# Altium project PCB_Project2.PrjPCB
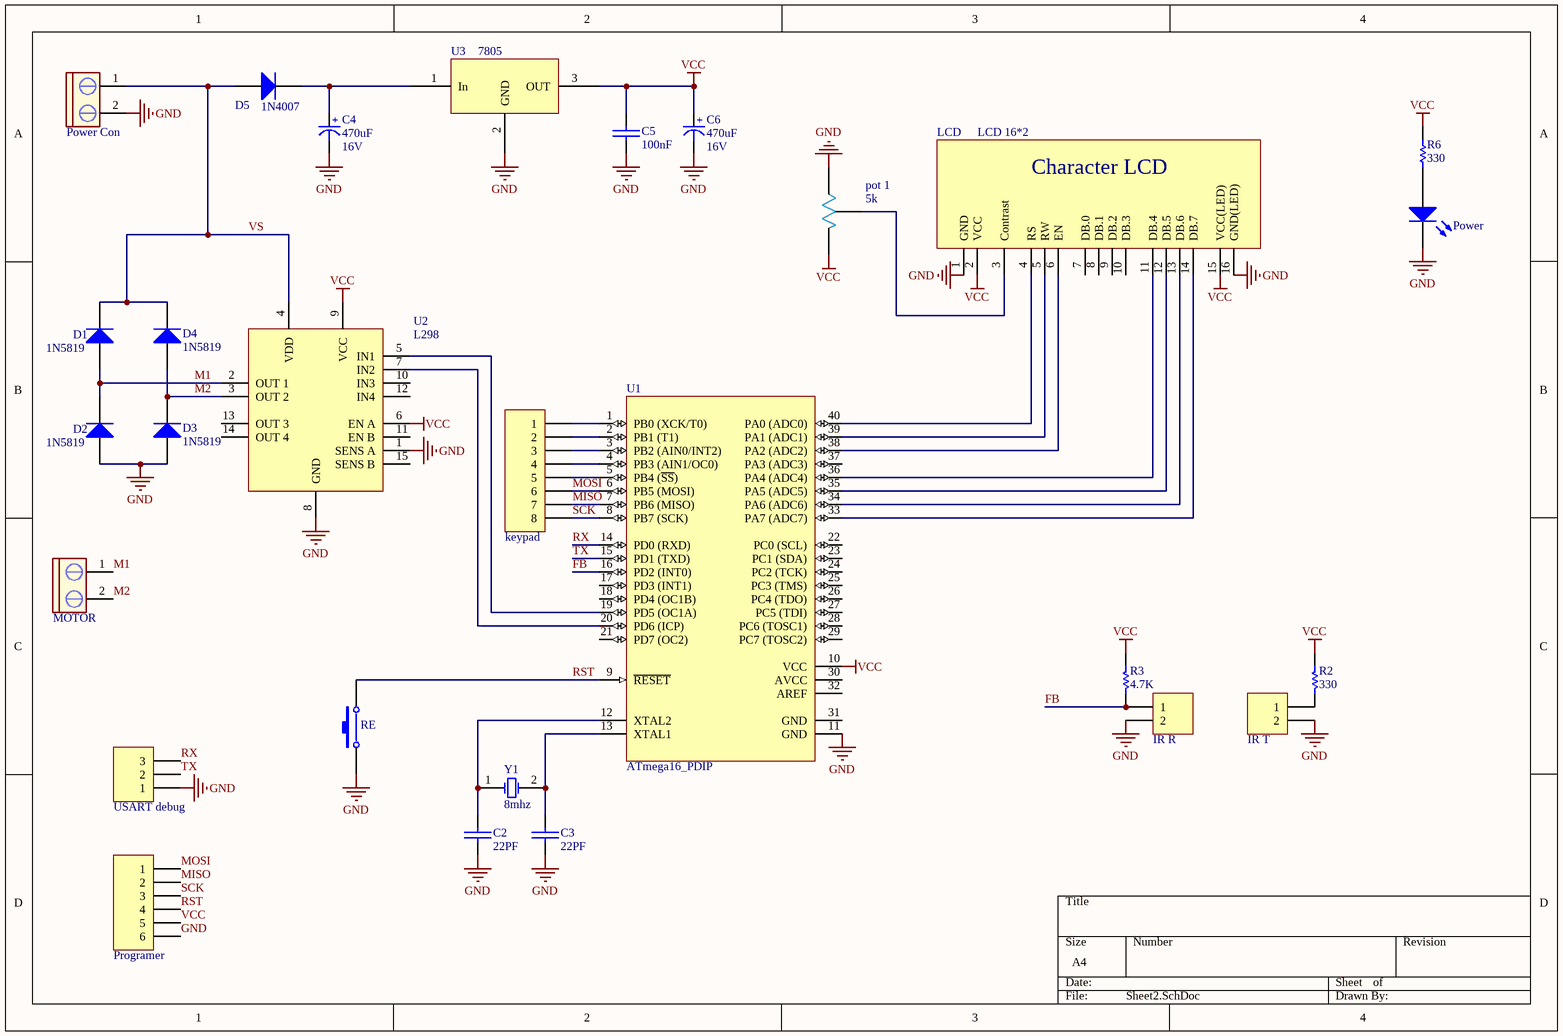
[diagram p0: Sheet2.SchDoc]
1 sheet, 28 parts. Net scope: global (net labels, ports and power ports of the same name join across sheets).
Board file: PCB2.PcbDoc

## Sheet Sheet2.SchDoc
size A4

### Parts
C2  22PF  [Cap - 100nF]
C3  22PF  [Cap - 100nF]
C4  Voltage: 16V  [cap 04]  (hidden comment: 470uF)
C5  100nF  [Cap - 100nF]
C6  Voltage: 16V  [cap 03]  (hidden comment: 470uF)
D1  1N5819  [DO-35]
D2  1N5819  [DO-35]
D3  1N5819  [DO-35]
D4  1N5819  [DO-35]
D5  1N4007  [Diode-1]
IR_R  Pin Header  [SIP2]  (value not drawn)
IR_T  Pin Header  [SIP2]  (value not drawn)
keypad  Pin Header  [SIP8]  (value not drawn)
LCD  LCD 16*2  [LCD2-16]
MOTOR  CON2 pin blue  [My_CN2]  (value not drawn)
pot_1  5k  [POT_1]
Power  LED 5mm  [LED-1]  (value not drawn)
Power_Con  CON2 pin blue  [My_CN2]  (value not drawn)
Programer  Pin Header  [SIP6]  (value not drawn)
R2  330  [AXIAL-0.3]
R3  4.7K  [AXIAL-0.3]
R6  330  [AXIAL-0.3]
RE  PB-2pin  [PB-2pin]  (value not drawn)
U1  ATmega16_PDIP  [DIP40]
U2  L298  [L298]
U3  7805  [TO-220]
USART_debug  Pin Header  [SIP3]  (value not drawn)
Y1  8mhz  [XTAL]

### Nets
GND: C2.2(-) C3.2(-) C4.2(-) C5.2(-) C6.2(-) D2.1(A) D3.1(A) IR_R.2 IR_T.2 LCD.1(GND) LCD.16(GND(LED)) pot_1.1 Power.2(K) Power_Con.2 Programer.6 RE.2 U1.11(GND) U2.1(SENS_A) U2.8(GND) U3.2(GND) USART_debug.1
VCC: C5.1(+) C6.1(+) LCD.2(VCC) LCD.15(VCC(LED)) pot_1.3 Programer.5 R2.1 R3.1 R6.1 U1.10(VCC) U2.6(EN_A) U2.9(VCC) U3.3(OUT)
FB: IR_R.1 R3.2 U1.16(PD2_(INT0))
M1: D1.1(A) D2.2(K) MOTOR.1 U2.2(OUT_1)
M2: D3.2(K) D4.1(A) MOTOR.2 U2.3(OUT_2)
MISO: keypad.7 Programer.2 U1.7(PB6_(MISO))
MOSI: keypad.6 Programer.1 U1.6(PB5_(MOSI))
RST: Programer.4 RE.1 U1.9(~{RESET})
RX: U1.14(PD0_(RXD)) USART_debug.3
SCK: keypad.8 Programer.3 U1.8(PB7_(SCK))
TX: U1.15(PD1_(TXD)) USART_debug.2
VS: D1.2(K) D4.2(K) D5.1(A) Power_Con.1 U2.4(VDD)
NetC2_1: C2.1(+) U1.12(XTAL2) Y1.1(OSC1)
NetC3_1: C3.1(+) U1.13(XTAL1) Y1.2(OSC2)
NetC4_1: C4.1(+) D5.2(K) U3.1(In)
NetIR_T_1: IR_T.1 R2.2
Netkeypad_1: keypad.1 U1.1(PB0_(XCK/T0))
Netkeypad_2: keypad.2 U1.2(PB1_(T1))
Netkeypad_3: keypad.3 U1.3(PB2_(AIN0/INT2))
Netkeypad_4: keypad.4 U1.4(PB3_(AIN1/OC0))
Netkeypad_5: keypad.5 U1.5(PB4_(~{SS}))
NetLCD_3: LCD.3(Contrast) pot_1.2
NetLCD_4: LCD.4(RS) U1.40(PA0_(ADC0))
NetLCD_5: LCD.5(RW) U1.39(PA1_(ADC1))
NetLCD_6: LCD.6(EN) U1.38(PA2_(ADC2))
NetLCD_11: LCD.11(DB.4) U1.36(PA4_(ADC4))
NetLCD_12: LCD.12(DB.5) U1.35(PA5_(ADC5))
NetLCD_13: LCD.13(DB.6) U1.34(PA6_(ADC6))
NetLCD_14: LCD.14(DB.7) U1.33(PA7_(ADC7))
NetPower_1: Power.1(A) R6.2
NetU1_19: U1.19(PD5_(OC1A)) U2.5(IN1)
NetU1_20: U1.20(PD6_(ICP)) U2.7(IN2)

Not connected (* = marked no-connect by the designer): LCD 7(DB.0) 8(DB.1) 9(DB.2) 10(DB.3); U1 17(PD3_(INT1)) 18(PD4_(OC1B)) 21(PD7_(OC2)) 22(PC0_(SCL)) 23(PC1_(SDA)) 24(PC2_(TCK)) 25(PC3_(TMS)) 26(PC4_(TDO)) 27(PC5_(TDI)) 28(PC6_(TOSC1)) 29(PC7_(TOSC2)) 30(AVCC) 31(GND) 32(AREF) 37(PA3_(ADC3)); U2 10(IN3) 11(EN_B) 12(IN4) 13(OUT_3) 14(OUT_4) 15(SENS_B)

### Notes on the sheet
- (in symbol LCD-CH) Character LCD

### Library data of the parts
C2 C3 C5 = Cap-Bipolar: Bipolar Capacitor; Voltage: 100V; Designer: Saeid Jorablo; Organazation: ControTec; Adding Date: 1387/12/20
  C2 C3: Value: 22PF
  C5: Value: 100nF
C4 C6 = Cap-Polar: Polar Capacitor; Designer: Saeid Jorablo; Organazation: ControTec; Adding Date: 1387/12/20; Value: 470uF
D1-D4 = Diode 1N4148: High Conductance Fast Diode; Published: 8-Jun-2000; LatestRevisionDate: 17-Jul-2002; LatestRevisionNote: Re-released for DXP Platform.; DatasheetVersion: 1997; PackageReference: DO-35; Publisher: Altium Limited; PackageDescription: Diode, Axial; Body 3.8 x 1.9 mm (LxDia. max), Lead Dia. 0.53 mm (max); Code_JEDEC: DO-204-AH; ComponentLink1Description: Manufacturer Link; ComponentLink1URL: http://www.fairchildsemi.com/; ComponentLink2Description: Datasheet; ComponentLink2URL: http://www.fairchildsemi.com/ds/1N%2F1N4148.pdf
D5 = Diode: Value: 1N4007
IR_R IR_T = CON2
keypad = CON8
LCD = LCD-CH
MOTOR Power_Con = CON2 pin blue: Connector blue screw
pot_1 = POT: value: 5k
Power = LED 5mm: Typical LED; Designer: Seyed Mohsen Ghasemian; Published: 07/31/2012; PackageReference: LED; Publisher: www.picpars.com; PackageDescription: LED; 2 Leads
Programer = CON6
R2 R3 R6 = Res: Resistor
  R2 R6: Value: 330
  R3: Value: 4.7K
RE = PB-2pin: Switch; E-mail: picpars@gmail.com; Designer: Seyed Mohsen Ghasemian; Publisher: www.picpars.com; WEB: www.picpars.com
U1 = ATmega16_PDIP: 8-Bit AVR Microcontroller
U3 = 7805: Reglator
USART_debug = CON3
Y1 = XTAL: XTAL Crystal; Company: E.P.I.L; Design Date: 11/04/2011; Value: 8mhz